# Altium schematic sheet radio_frequency.SchDoc
size A
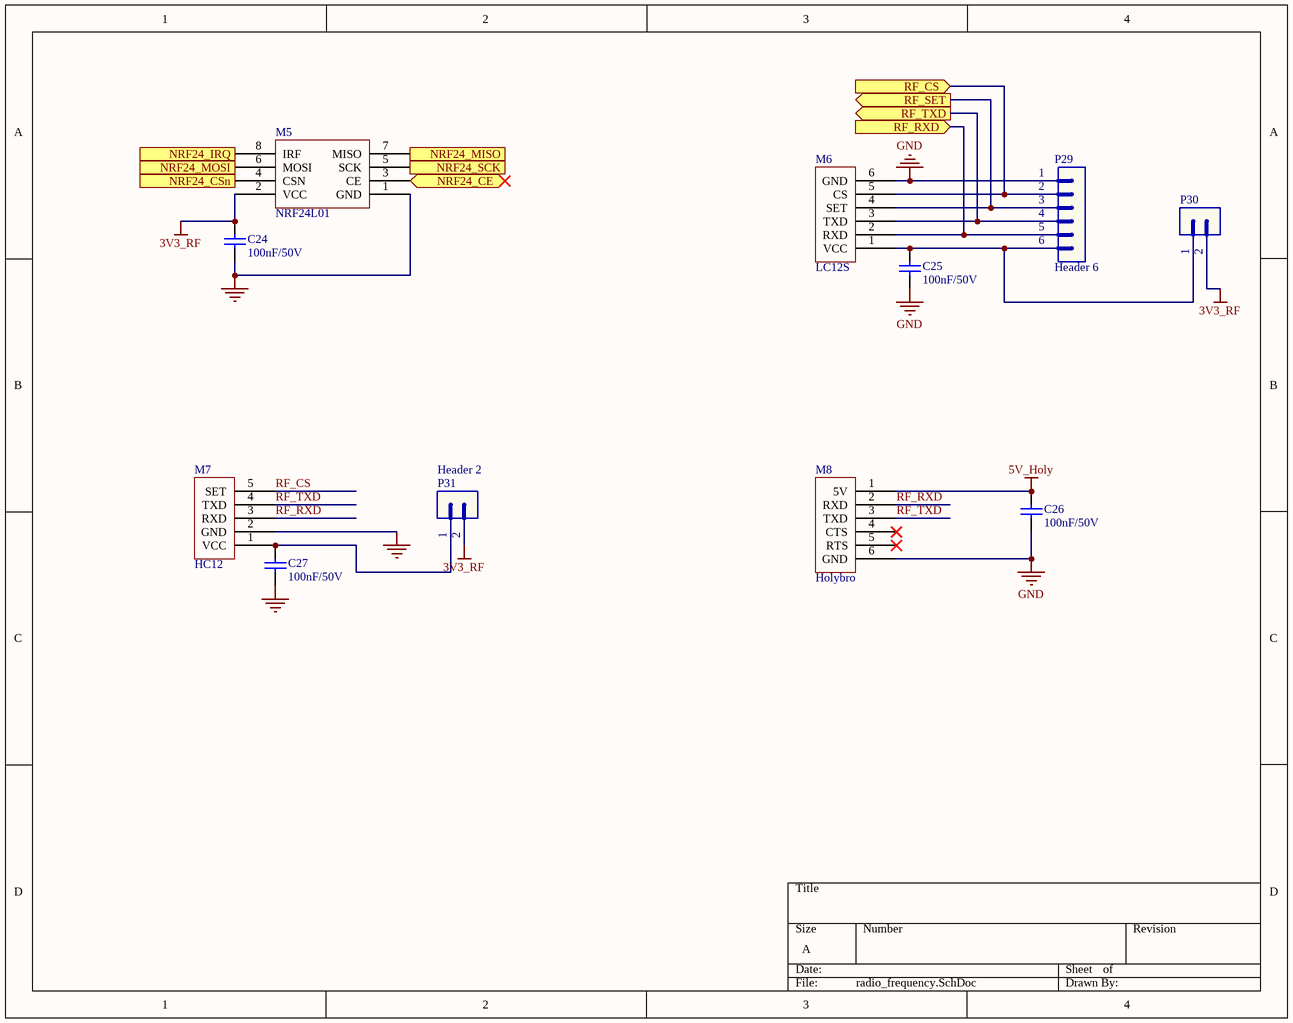
[diagram p0: radio_frequency.SchDoc]

## Parts
C24  value 100nF/50V  [CAP-SM-0805]  (hidden comment: Cap-100nF-50V-0805)
C25  value 100nF/50V  [CAP-SM-0805]  (hidden comment: Cap-100nF-50V-0805)
C26  value 100nF/50V  [CAP-SM-0805]  (hidden comment: Cap-100nF-50V-0805)
C27  value 100nF/50V  [CAP-SM-0805]  (hidden comment: Cap-100nF-50V-0805)
M5  NRF24L01  [NRF24L01]
M6  LC12S  [LC12S]
M7  HC12  [HC12]
M8  Holybro  [Holybro]
P29  Header 6  [JP6]
P30  Header 2  [JP2]  (value not drawn)
P31  Header 2  [JP2]

## Ports
NRF24_CE (bidir), NRF24_CSn (in), NRF24_IRQ (out), NRF24_MISO (out), NRF24_MOSI (in), NRF24_SCK (in), RF_CS (in), RF_RXD (in), RF_SET (out), RF_TXD (out)

## Nets
3V3_RF: C24.2 M5.2(VCC) P30.2 P31.2
5V_Holy: C26.2 M8.1(5V)
GND: C24.1 C25.2 C26.1 C27.1 M5.1(GND) M6.6(GND) M7.2(GND) M8.6(GND) P29.1
NRF24_CE: M5.3(CE) ; port NRF24_CE
NRF24_CSn: M5.4(CSN) ; port NRF24_CSn
NRF24_IRQ: M5.8(IRF) ; port NRF24_IRQ
NRF24_MISO: M5.7(MISO) ; port NRF24_MISO
NRF24_MOSI: M5.6(MOSI) ; port NRF24_MOSI
NRF24_SCK: M5.5(SCK) ; port NRF24_SCK
RF_CS: M6.5(CS) P29.2 ; port RF_CS
RF_CS: M7.5(SET)  [a separate net that carries the same name]
RF_RXD: M6.2(RXD) P29.5 ; port RF_RXD
RF_RXD: M7.3(RXD) M8.2(RXD)  [a separate net that carries the same name]
RF_SET: M6.4(SET) P29.3 ; port RF_SET
RF_TXD: M6.3(TXD) P29.4 ; port RF_TXD
RF_TXD: M7.4(TXD) M8.3(TXD)  [a separate net that carries the same name]
NetC25_1: C25.1 M6.1(VCC) P29.6 P30.1
NetC27_2: C27.2 M7.1(VCC) P31.1

Not connected (* = marked no-connect by the designer): M8 4(CTS)* 5(RTS)*

## Library data of the parts
C24-C27 = Cap-100nF-50V-0805: CAP CER 0.1UF 50V Y5V 0805; Manufacturer: Samsung Electro-Mechanics; Manufacturer Part Number: CL21F104ZBCNNNC; Local Supplier: thegioiic; Local Supplier Link: https://thegioiic.com/products/tu-100nf-0-1uf-50v-0805; Supplier 1: Digikey; Supplier 1 Part Number: 1276-1007-1-ND; Supplier 1 Link: https://www.digikey.com/product-detail/en/samsung-electro-mechanics/CL21F104ZBCNNNC/1276-1007-1-ND/3889093
P29 = Header 6: Header, 6-Pin; LatestRevisionDate: 17-Jul-2002; LatestRevisionNote: Re-released for DXP Platform.; Publisher: Altium Limited
P30 P31 = Header 2: Header, 2-Pin; LatestRevisionDate: 17-Jul-2002; LatestRevisionNote: Re-released for DXP Platform.; Publisher: Altium Limited
M6 = LC12S: Local Supplier: HShop; Local Supplier Link: https://hshop.vn/products/mach-thu-phat-rf-uart-lc12s-2-4ghz?fbclid=IwAR1M9YDa-GitOgYklxeG5eoXHMme_RQQZ19pTuO3FE9QmjSNk3aG2x454fg; Local Supplier Part Number: HS000895; Manufacturer: *; Manufacturer Part Number: *